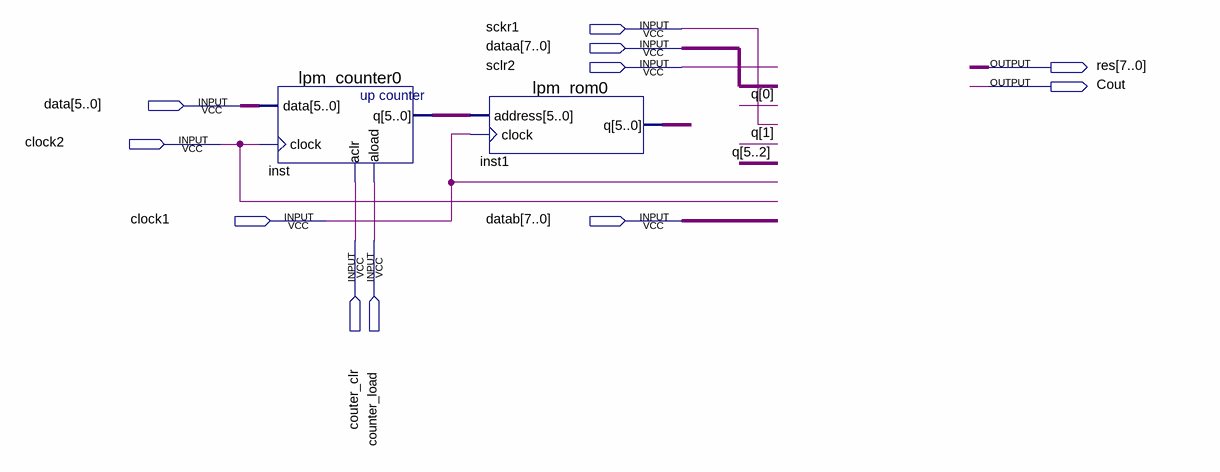
[diagram p0: schematic sheet]
// Quartus schematic counter.bdf as structural Verilog: 2 symbols, 11 pins
module counter (
  input  sckr1,
  input  [7:0] dataa,
  input  sclr2,
  input  [5:0] data,
  input  clock2,
  input  clock1,
  input  [7:0] datab,
  input  couter_clr,
  input  counter_load,
  output [7:0] res,
  output Cout
);

  wire [5:0] inst1_q, inst_q;

  lpm_counter0 inst (.data(data), .clock(clock2), .aclr(couter_clr), .aload(counter_load), .q(inst_q));
  lpm_rom0 inst1 (.address(inst_q), .clock(clock1), .q(inst1_q));
endmodule
